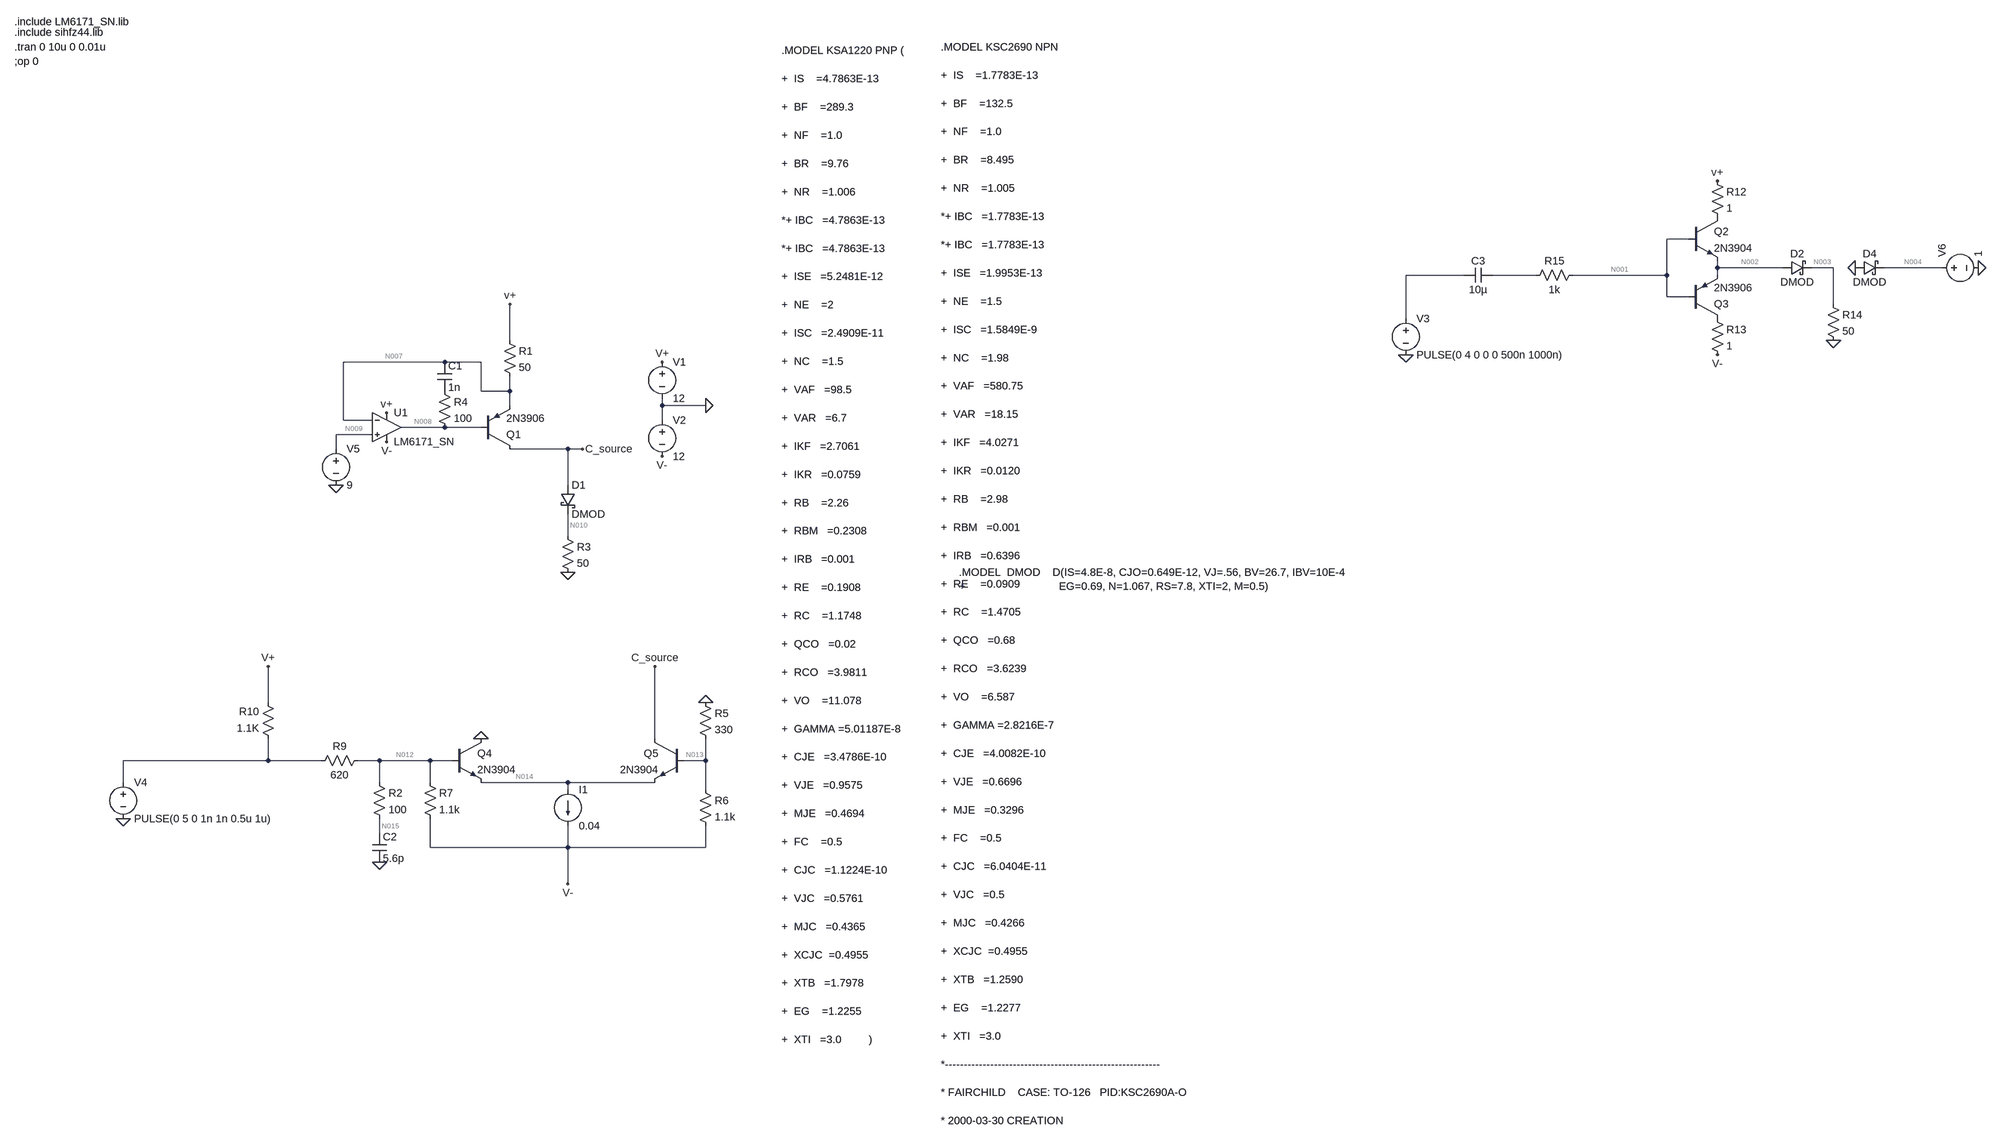
[diagram p0: schematic DC-DC_load.asc]
DC-DC_load.asc, the LTspice schematic file:
Version 4
SHEET 1 4620 1668
WIRE 3936 16 3888 16
WIRE 4000 80 4000 64
WIRE 4144 80 4000 80
WIRE 4256 80 4208 80
WIRE 4496 80 4368 80
WIRE 3440 96 3312 96
WIRE 3600 96 3504 96
WIRE 3888 96 3888 16
WIRE 3888 96 3680 96
WIRE 4000 96 4000 80
WIRE 3888 144 3888 96
WIRE 3936 144 3888 144
WIRE 4256 160 4256 80
WIRE 3312 192 3312 96
WIRE 736 240 736 160
WIRE 592 288 368 288
WIRE 672 288 592 288
WIRE 672 352 672 288
WIRE 736 352 736 320
WIRE 736 352 672 352
WIRE 736 384 736 352
WIRE 1072 384 1072 368
WIRE 1168 384 1072 384
WIRE 368 416 368 288
WIRE 432 416 368 416
WIRE 1072 416 1072 384
WIRE 592 432 496 432
WIRE 672 432 592 432
WIRE 432 448 352 448
WIRE 352 480 352 448
WIRE 864 480 736 480
WIRE 896 480 864 480
WIRE 864 560 864 480
WIRE 864 672 864 624
WIRE 144 1040 144 960
WIRE 1056 1120 1056 960
WIRE 144 1168 144 1120
WIRE 144 1168 -176 1168
WIRE 320 1168 144 1168
WIRE 448 1168 400 1168
WIRE 560 1168 448 1168
WIRE 608 1168 560 1168
WIRE 1168 1168 1168 1120
WIRE 1168 1168 1120 1168
WIRE -176 1216 -176 1168
WIRE 448 1216 448 1168
WIRE 560 1216 560 1168
WIRE 864 1216 672 1216
WIRE 1056 1216 864 1216
WIRE 864 1232 864 1216
WIRE 1168 1232 1168 1168
WIRE 448 1328 448 1296
WIRE 560 1360 560 1296
WIRE 864 1360 864 1312
WIRE 864 1360 560 1360
WIRE 1168 1360 1168 1312
WIRE 1168 1360 864 1360
WIRE 864 1440 864 1360
FLAG 1168 384 0
FLAG 1072 288 V+
FLAG 1072 496 V-
FLAG 464 464 V-
FLAG 464 400 v+
FLAG 736 160 v+
FLAG 864 752 0
FLAG 672 1120 0
FLAG 1168 1040 0
FLAG 864 1440 V-
FLAG 144 960 V+
FLAG 896 480 C_source
FLAG 3312 272 0
FLAG 4000 -112 v+
FLAG 448 1392 0
FLAG 352 560 0
FLAG 4000 272 V-
FLAG 4256 240 0
FLAG 4576 80 0
FLAG 4304 80 0
FLAG -176 1296 0
FLAG 1056 960 C_source
DATAFLAG 720 352 ""
DATAFLAG 784 480 ""
DATAFLAG 464 1168 ""
DATAFLAG 1056 1072 ""
SYMBOL Opamps\\opamp2 464 368 R0
SYMATTR InstName U1
SYMATTR Value LM6171_SN
SYMBOL voltage 1072 272 R0
WINDOW 123 0 0 Left 2
WINDOW 39 0 0 Left 2
SYMATTR InstName V1
SYMATTR Value 12
SYMBOL voltage 1072 400 R0
WINDOW 123 0 0 Left 2
WINDOW 39 0 0 Left 2
SYMATTR InstName V2
SYMATTR Value 12
SYMBOL res 720 224 R0
SYMATTR InstName R1
SYMATTR Value 50
SYMBOL res 848 656 R0
SYMATTR InstName R3
SYMATTR Value 50
SYMBOL res 1152 1024 R0
SYMATTR InstName R5
SYMATTR Value 330
SYMBOL res 1152 1216 R0
SYMATTR InstName R6
SYMATTR Value 1.1k
SYMBOL res 544 1200 R0
SYMATTR InstName R7
SYMATTR Value 1.1k
SYMBOL res 416 1152 R90
WINDOW 0 0 56 VBottom 2
WINDOW 3 32 56 VTop 2
SYMATTR InstName R9
SYMATTR Value 620
SYMBOL res 160 1136 R180
WINDOW 0 36 76 Left 2
WINDOW 3 36 40 Left 2
SYMATTR InstName R10
SYMATTR Value 1.1K
SYMBOL npn 608 1120 R0
SYMATTR InstName Q4
SYMATTR Value 2N3904
SYMBOL npn 1120 1120 M0
SYMATTR InstName Q5
SYMATTR Value 2N3904
SYMBOL res 576 336 R0
SYMATTR InstName R4
SYMATTR Value 100
SYMBOL cap 576 288 R0
SYMATTR InstName C1
SYMATTR Value 1n
SYMBOL pnp 672 480 M180
SYMATTR InstName Q1
SYMATTR Value 2N3906
SYMBOL npn 3936 -32 R0
SYMATTR InstName Q2
SYMATTR Value 2N3904
SYMBOL res 3984 -128 R0
SYMATTR InstName R12
SYMATTR Value 1
SYMBOL res 3984 176 R0
SYMATTR InstName R13
SYMATTR Value 1
SYMBOL voltage 3312 176 R0
WINDOW 123 0 0 Left 0
WINDOW 39 0 0 Left 0
SYMATTR InstName V3
SYMATTR Value PULSE(0 4 0 0 0 500n 1000n)
SYMBOL res 432 1200 R0
SYMATTR InstName R2
SYMATTR Value 100
SYMBOL cap 432 1328 R0
SYMATTR InstName C2
SYMATTR Value 5.6p
SYMBOL schottky 848 560 R0
SYMATTR InstName D1
SYMATTR Value DMOD
SYMATTR Description Diode
SYMATTR Type diode
SYMBOL voltage 352 464 R0
WINDOW 123 0 0 Left 0
WINDOW 39 0 0 Left 0
SYMATTR InstName V5
SYMATTR Value 9
SYMBOL pnp 3936 192 M180
SYMATTR InstName Q3
SYMATTR Value 2N3906
SYMBOL res 4240 144 R0
SYMATTR InstName R14
SYMATTR Value 50
SYMBOL schottky 4144 96 R270
WINDOW 0 32 32 VTop 2
WINDOW 3 0 32 VBottom 2
SYMATTR InstName D2
SYMATTR Value DMOD
SYMATTR Description Diode
SYMATTR Type diode
SYMBOL res 3696 80 R90
WINDOW 0 0 56 VBottom 2
WINDOW 3 32 56 VTop 2
SYMATTR InstName R15
SYMATTR Value 1k
SYMBOL cap 3504 80 R90
WINDOW 0 0 32 VBottom 2
WINDOW 3 32 32 VTop 2
SYMATTR InstName C3
SYMATTR Value 10µ
SYMBOL schottky 4304 96 R270
WINDOW 0 32 32 VTop 2
WINDOW 3 0 32 VBottom 2
SYMATTR InstName D4
SYMATTR Value DMOD
SYMATTR Description Diode
SYMATTR Type diode
SYMBOL voltage 4480 80 R270
WINDOW 123 0 0 Left 0
WINDOW 39 0 0 Left 0
SYMATTR InstName V6
SYMATTR Value 1
SYMBOL voltage -176 1200 R0
WINDOW 123 0 0 Left 0
WINDOW 39 0 0 Left 0
SYMATTR InstName V4
SYMATTR Value PULSE(0 5 0 1n 1n 0.5u 1u)
SYMBOL current 864 1232 R0
WINDOW 123 0 0 Left 0
WINDOW 39 0 0 Left 0
SYMATTR InstName I1
SYMATTR Value 0.04
TEXT -416 -376 Left 2 !;op 0
TEXT -416 -464 Left 2 !.include LM6171_SN.lib
TEXT -416 -408 Left 2 !.tran 0 10u 0 0.01u
TEXT -416 -440 Left 2 !.include sihfz44.lib
TEXT 1664 -400 Left 2 !.MODEL KSA1220 PNP ( \n\n+  IS    =4.7863E-13      \n\n+  BF    =289.3\n\n+  NF    =1.0 \n\n+  BR    =9.76\n\n+  NR    =1.006\n\n*+ IBC   =4.7863E-13\n\n*+ IBC   =4.7863E-13\n\n+  ISE   =5.2481E-12\n\n+  NE    =2\n\n+  ISC   =2.4909E-11\n\n+  NC    =1.5\n\n+  VAF   =98.5\n\n+  VAR   =6.7\n\n+  IKF   =2.7061\n\n+  IKR   =0.0759\n\n+  RB    =2.26\n\n+  RBM   =0.2308\n\n+  IRB   =0.001\n\n+  RE    =0.1908\n\n+  RC    =1.1748\n\n+  QCO   =0.02\n\n+  RCO   =3.9811\n\n+  VO    =11.078\n\n+  GAMMA =5.01187E-8\n\n+  CJE   =3.4786E-10\n\n+  VJE   =0.9575\n\n+  MJE   =0.4694\n\n+  FC    =0.5\n\n+  CJC   =1.1224E-10\n\n+  VJC   =0.5761\n\n+  MJC   =0.4365\n\n+  XCJC  =0.4955   \n\n+  XTB   =1.7978    \n\n+  EG    =1.2255 \n\n+  XTI   =3.0         )
TEXT 2016 -408 Left 2 !.MODEL KSC2690 NPN\n\n+  IS    =1.7783E-13      \n\n+  BF    =132.5\n\n+  NF    =1.0 \n\n+  BR    =8.495\n\n+  NR    =1.005\n\n*+ IBC   =1.7783E-13 \n\n*+ IBC   =1.7783E-13 \n\n+  ISE   =1.9953E-13\n\n+  NE    =1.5\n\n+  ISC   =1.5849E-9\n\n+  NC    =1.98\n\n+  VAF   =580.75\n\n+  VAR   =18.15\n\n+  IKF   =4.0271\n\n+  IKR   =0.0120\n\n+  RB    =2.98\n\n+  RBM   =0.001\n\n+  IRB   =0.6396\n\n+  RE    =0.0909\n\n+  RC    =1.4705\n\n+  QCO   =0.68\n\n+  RCO   =3.6239\n\n+  VO    =6.587\n\n+  GAMMA =2.8216E-7\n\n+  CJE   =4.0082E-10\n\n+  VJE   =0.6696\n\n+  MJE   =0.3296\n\n+  FC    =0.5\n\n+  CJC   =6.0404E-11\n\n+  VJC   =0.5\n\n+  MJC   =0.4266\n\n+  XCJC  =0.4955   \n\n+  XTB   =1.2590    \n\n+  EG    =1.2277 \n\n+  XTI   =3.0         \n\n*---------------------------------------------------------\n\n* FAIRCHILD    CASE: TO-126   PID:KSC2690A-O\n\n* 2000-03-30 CREATION
TEXT 2056 752 Left 2 !.MODEL  DMOD    D(IS=4.8E-8, CJO=0.649E-12, VJ=.56, BV=26.7, IBV=10E-4\n+                               EG=0.69, N=1.067, RS=7.8, XTI=2, M=0.5)

The netlist it stands for:
* DC-DC_load.asc
XU1 N009 N007 V+ V- N008 LM6171_SN  ; pins In+ In- V+ V- OUT
V1 V+ 0 12
V2 0 V- 12
R1 V+ N007 50
R3 N010 0 50
R5 0 N013 330
R6 N013 V- 1.1k
R7 N012 V- 1.1k
R9 N012 N011 620
R10 N011 V+ 1.1K
Q4 0 N012 N014 0 2N3904
Q5 C_source N013 N014 0 2N3904
R4 P001 N008 100
C1 N007 P001 1n
Q1 C_source N008 N007 0 2N3906
Q2 P002 N001 N002 0 2N3904
R12 V+ P002 1
R13 P003 V- 1
V3 N005 0 PULSE(0 4 0 0 0 500n 1000n)
R2 N012 N015 100
C2 N015 0 5.6p
D1 C_source N010 DMOD
V5 N009 0 9
Q3 P003 N001 N002 0 2N3906
R14 N003 0 50
D2 N002 N003 DMOD
R15 N001 N006 1k
C3 N006 N005 10µ
D4 0 N004 DMOD
V6 N004 0 1
V4 N011 0 PULSE(0 5 0 1n 1n 0.5u 1u)
I1 N014 V- 0.04
.model D D
.lib standard.dio
.model NPN NPN
.model PNP PNP
.lib standard.bjt
;op 0
.include LM6171_SN.lib
.tran 0 10u 0 0.01u
.include sihfz44.lib
.MODEL KSA1220 PNP (
+  IS    =4.7863E-13
+  BF    =289.3
+  NF    =1.0
+  BR    =9.76
+  NR    =1.006
*+ IBC   =4.7863E-13
*+ IBC   =4.7863E-13
+  ISE   =5.2481E-12
+  NE    =2
+  ISC   =2.4909E-11
+  NC    =1.5
+  VAF   =98.5
+  VAR   =6.7
+  IKF   =2.7061
+  IKR   =0.0759
+  RB    =2.26
+  RBM   =0.2308
+  IRB   =0.001
+  RE    =0.1908
+  RC    =1.1748
+  QCO   =0.02
+  RCO   =3.9811
+  VO    =11.078
+  GAMMA =5.01187E-8
+  CJE   =3.4786E-10
+  VJE   =0.9575
+  MJE   =0.4694
+  FC    =0.5
+  CJC   =1.1224E-10
+  VJC   =0.5761
+  MJC   =0.4365
+  XCJC  =0.4955
+  XTB   =1.7978
+  EG    =1.2255
+  XTI   =3.0         )
.MODEL KSC2690 NPN
+  IS    =1.7783E-13
+  BF    =132.5
+  NF    =1.0
+  BR    =8.495
+  NR    =1.005
*+ IBC   =1.7783E-13
*+ IBC   =1.7783E-13
+  ISE   =1.9953E-13
+  NE    =1.5
+  ISC   =1.5849E-9
+  NC    =1.98
+  VAF   =580.75
+  VAR   =18.15
+  IKF   =4.0271
+  IKR   =0.0120
+  RB    =2.98
+  RBM   =0.001
+  IRB   =0.6396
+  RE    =0.0909
+  RC    =1.4705
+  QCO   =0.68
+  RCO   =3.6239
+  VO    =6.587
+  GAMMA =2.8216E-7
+  CJE   =4.0082E-10
+  VJE   =0.6696
+  MJE   =0.3296
+  FC    =0.5
+  CJC   =6.0404E-11
+  VJC   =0.5
+  MJC   =0.4266
+  XCJC  =0.4955
+  XTB   =1.2590
+  EG    =1.2277
+  XTI   =3.0
*---------------------------------------------------------
* FAIRCHILD    CASE: TO-126   PID:KSC2690A-O
* 2000-03-30 CREATION
.MODEL  DMOD    D(IS=4.8E-8, CJO=0.649E-12, VJ=.56, BV=26.7, IBV=10E-4
+                               EG=0.69, N=1.067, RS=7.8, XTI=2, M=0.5)
.backanno
.end

* Results of the author's LTspice run, read from the files saved beside the schematic
* Operating Point, zero values left out:
*   V(n009) = 9 V
*   V(v+) = 12 V
*   V(n007) = 9.001 V
*   V(v-) = -12 V
*   V(n008) = 8.226 V
*   V(n010) = 989.7 mV
*   V(n013) = -2.805 V
*   V(n012) = -4.326 V
*   V(n014) = -3.563 V
*   V(c_source) = 1.501 V
*   V(p001) = 8.226 V
*   V(p002) = 12 V
*   V(p003) = -12 V
*   V(n015) = -4.326 V
*   V(n004) = 1 V
*   Ic(Q3) = -12.01 pA
*   Ib(Q3) = 12 pA
*   Ic(Q1) = -59.65 mA
*   Ib(Q1) = -318.5 µA
*   Ie(Q1) = 59.97 mA
*   Ic(Q2) = 12.01 pA
*   Ib(Q2) = -12 pA
*   Ic(Q5) = 39.86 mA
*   Ib(Q5) = 139.6 µA
*   Ie(Q5) = -40 mA
*   Ic(Q4) = 4.328 pA
*   Ib(Q4) = -5.091 pA
*   I(D4) = -48 nA
*   I(D1) = 19.79 mA
*   I(I1) = 40 mA
*   I(R13) = 12 pA
*   I(R12) = 12 pA
*   I(R10) = -10.91 mA
*   I(R9) = -6.977 mA
*   I(R7) = 6.977 mA
*   I(R6) = 8.359 mA
*   I(R5) = 8.499 mA
*   I(R3) = 19.79 mA
*   I(R1) = 59.97 mA
*   I(V4) = 3.932 mA
*   I(V6) = -48 nA
*   I(V5) = -1.225 µA
*   I(V2) = -57.9 mA
*   I(V1) = -73.13 mA
*   Ix(u1:1) = 1.225 µA
*   Ix(u1:2) = 1.195 µA
*   Ix(u1:3) = 2.247 mA
*   Ix(u1:4) = -2.565 mA
*   Ix(u1:5) = 318.5 µA
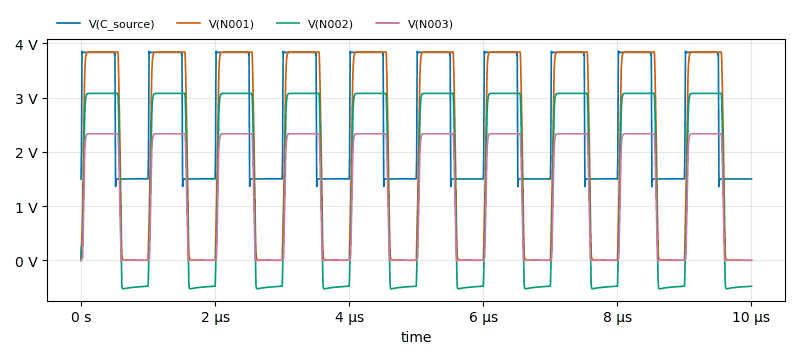
[diagram p1: Transient Analysis of DC-DC_load.asc, plotted from the saved traces]
* Transient Analysis, 1 run:
*   V(C_source): min 1.36 V, max 3.856 V, average 2.669 V, rms 2.911 V, last 1.501 V
*   V(N001): min 0 V, max 3.841 V, average 2.114 V, rms 2.798 V, last 1.191 mV
*   V(N002): min -525.5 mV, max 3.078 V, average 1.463 V, rms 2.249 V, last -478 mV
*   V(N003): min -3.698 mV, max 2.334 V, average 1.247 V, rms 1.683 V, last -980.4 nV